# EAGLE design LabPower test3 (EAGLE 7.6.0)

## Sheet 1 of 3: HV Side
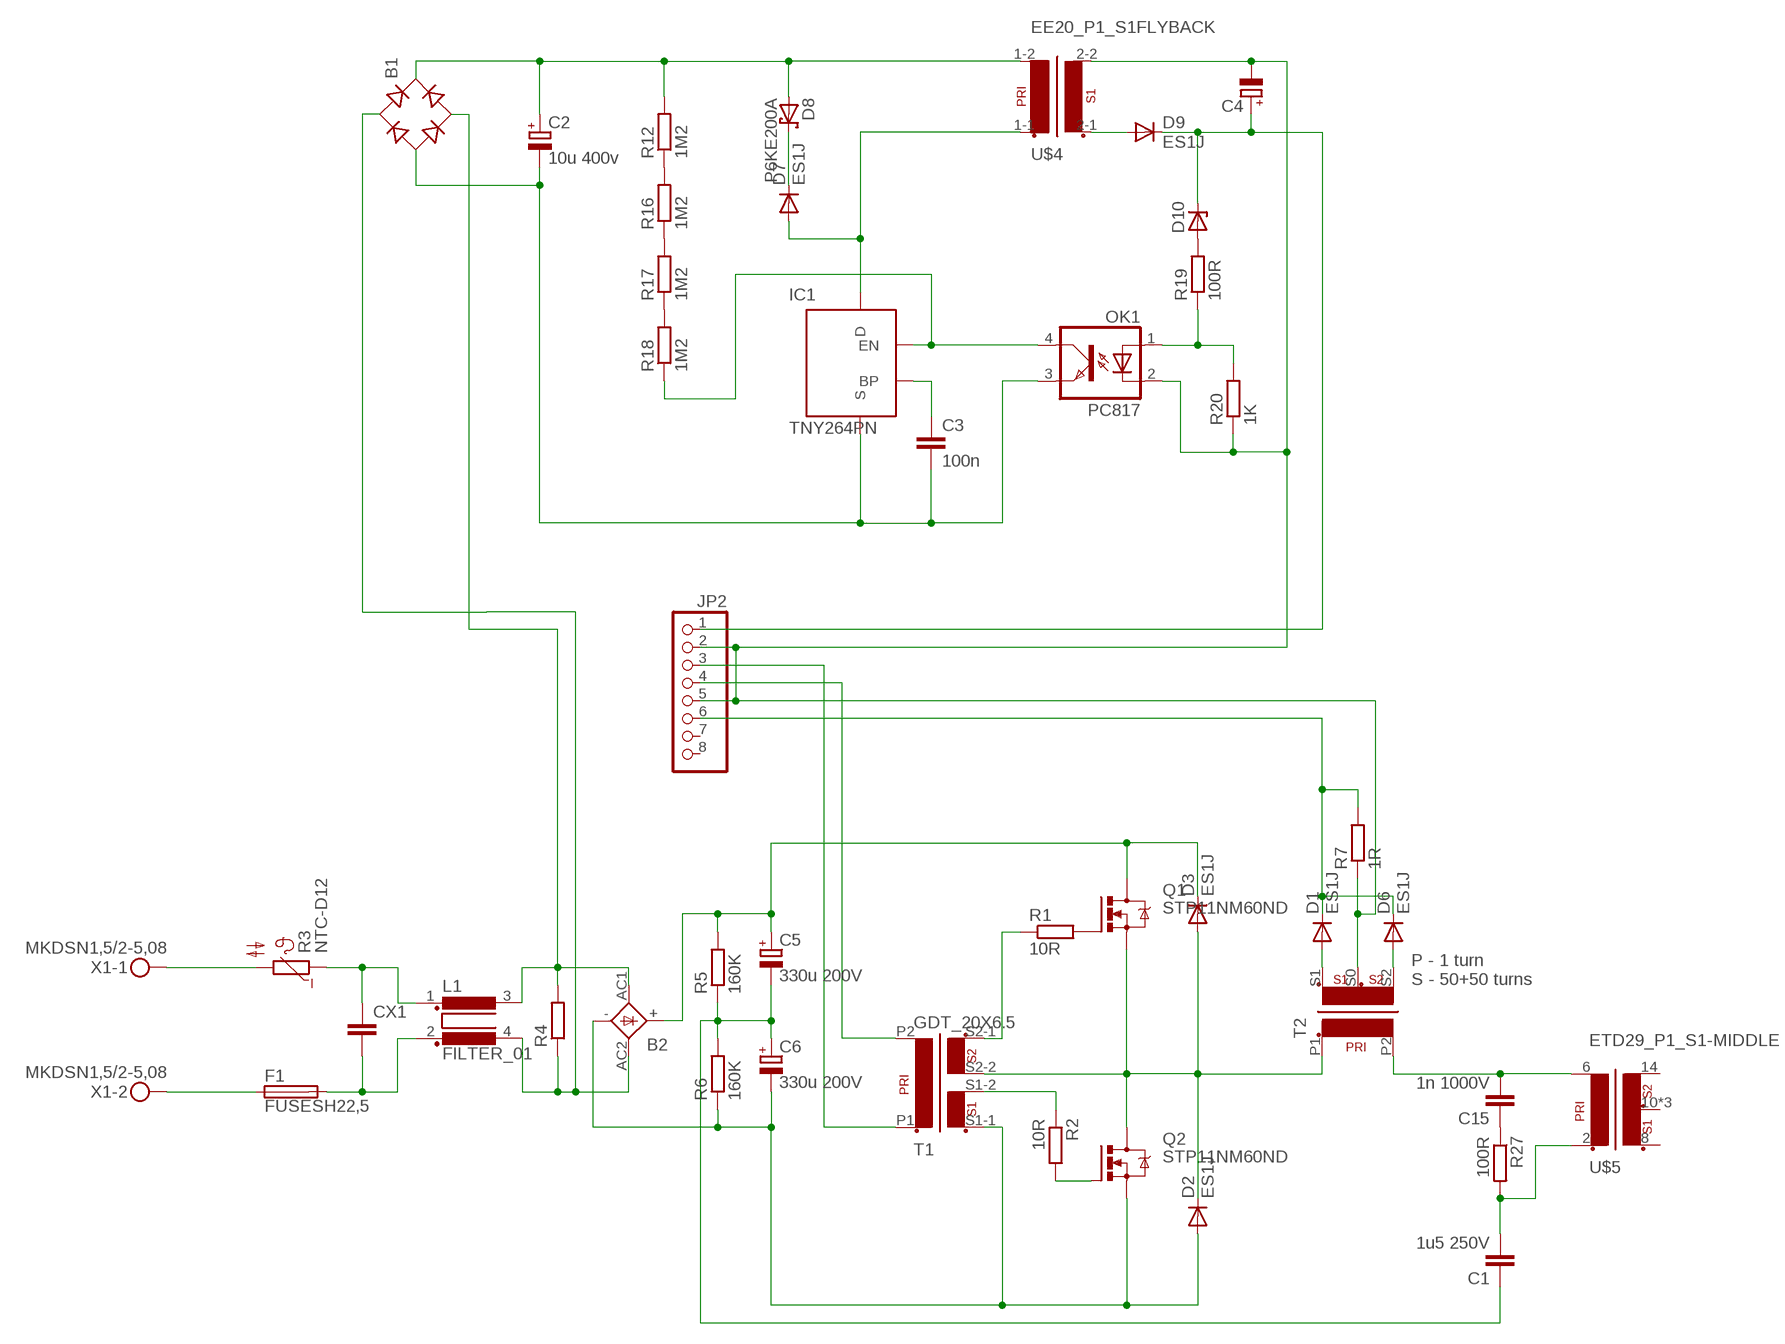
[diagram p0: schematic, sheet 1]

### Parts
B1  RB1A  [RB1A]
B2  KBL  [KBL]
C1  1u5 250V  C-EU225-074X268  [C225-074X268]
C2  10u 400v  CPOL-EUE5-13  [E5-13]
C3  100n  C-EUC0805  [C0805]
C4  CPOL-EUE2.5-7  [E2,5-7]
C5  330u 200V  CPOL-EUE10-22.5  [EB22,5D]
C6  330u 200V  CPOL-EUE10-22.5  [EB22,5D]
C15  1n 1000V  C-EU050-025X075  [C050-025X075]
CX1  CXXC15B8  [XC15B8]
D1  ES1J  DIODE-DO214AC  [DO214AC]
D2  ES1J  DIODE-DO214AC  [DO214AC]
D3  ES1J  DIODE-DO214AC  [DO214AC]
D6  ES1J  DIODE-DO214AC  [DO214AC]
D7  ES1J  DIODE-DO214AC  [DO214AC]
D8  P6KE200A  P6KEXX  [CB417-15]
D9  ES1J  DIODE-DO214AC  [DO214AC]
D10  ZENER-DIODEDO41Z10  [DO41Z10]
F1  FUSESH22,5  [SH22,5]
IC1  TNY264PN  [DIP-8B]
JP2  PINHD-1X8  [1X08]
L1  FILTER_01  [82721K]
OK1  PC817  [DIL04]
Q1  STP11NM60ND  IRF740  [TO220BV]
Q2  STP11NM60ND  IRF740  [TO220BV]
R1  10R  R-EU_R0805  [R0805]
R2  10R  R-EU_R0805  [R0805]
R3  NTC-D12  [NTC-D12]
R4  R-EU_0309/10  [0309/10]
R5  160K  R-EU_0207/12  [0207/12]
R6  160K  R-EU_0207/12  [0207/12]
R7  1R  R-EU_R1206  [R1206]
R12  1M2  R-EU_R0805  [R0805]
R16  1M2  R-EU_R0805  [R0805]
R17  1M2  R-EU_R0805  [R0805]
R18  1M2  R-EU_R0805  [R0805]
R19  100R  R-EU_R0805  [R0805]
R20  1K  R-EU_R0805  [R0805]
R27  100R  R-EU_0617/17  [0617/17]
T1  GDT_20X6.5  [GDT_20X6.5]
T2  CURRENT  [T_10X6X3]
U$4  EE20_P1_S1FLYBACK  [EE20_P1_S1-REV-4PIN]
U$5  ETD29_P1_S1-MIDDLE  [ETD29]
X1  MKDSN1,5/2-5,08  [MKDSN1,5/2-5,08]

### Nets
300V: B2.+ C5.+ D3.C Q1.D R5.2
AC1: B1.AC1 B2.AC2(AC1) L1.4 R4.1
AC2: B1.AC2 B2.AC1(AC2) L1.3 R4.2
N$1: C1.1 C5.- C6.+ R5.1 R6.2
N$2: D2.C D3.A Q1.S Q2.D T1.S2-2 T2.P1(P1-1)
N$3: C1.2 R27.2 U$5.2(P1-1)
N$5: C15.2 T2.P2(P1-2) U$5.6(P1-2)
N$6: F1.1 X1.2
N$7: R3.2 X1.1
N$9: CX1.1 L1.1 R3.1
N$10: CX1.2 F1.2 L1.2
N$17: B2.- C6.- D2.A Q2.S R6.1 T1.S1-1
N$18: JP2.3 T1.P1(P1-1)
N$20: Q1.G R1.2
N$21: Q2.G R2.2
N$22: JP2.4 T1.P2(P1-2)
N$23: R1.1 T1.S2-1
N$24: R2.1 T1.S1-2
N$27: D1.A T2.S1
N$28: D6.A T2.S2
N$30: D1.C D6.C JP2.6 R7.2
N$31: C4.- JP2.2 JP2.5 OK1.2(C) R7.1 R20.1 T2.S0(SM) U$4.2-2(S1-2)
N$32: B1.+ C2.+ D8.A R12.2 U$4.1-2
N$33: C15.1 R27.1
N$35: B1.- C2.- C3.2 IC1.2(S) IC1.3(S) IC1.7(S) IC1.8(S) OK1.3(EMIT)
N$36: D7.A IC1.5(D) U$4.1-1
N$38: D7.C D8.C
N$39: C3.1 IC1.1(BP)
N$40: IC1.4(EN) OK1.4(COL) R18.1
N$41: C4.+ D9.C D10.C JP2.1
N$43: R12.1 R16.2
N$44: R16.1 R17.2
N$45: R17.1 R18.2
N$48: D10.A R19.2
N$49: OK1.1(A) R19.1 R20.2
N$50: D9.A U$4.2-1(S1-1)
Unconnected: JP2.7 JP2.8 U$5.8(S1) U$5.10(SM) U$5.11(SM) U$5.12(SM) U$5.14(S2)

### Notes on the sheet
- P - 1 turn
  S - 50+50 turns

## Sheet 2 of 3: LV Side
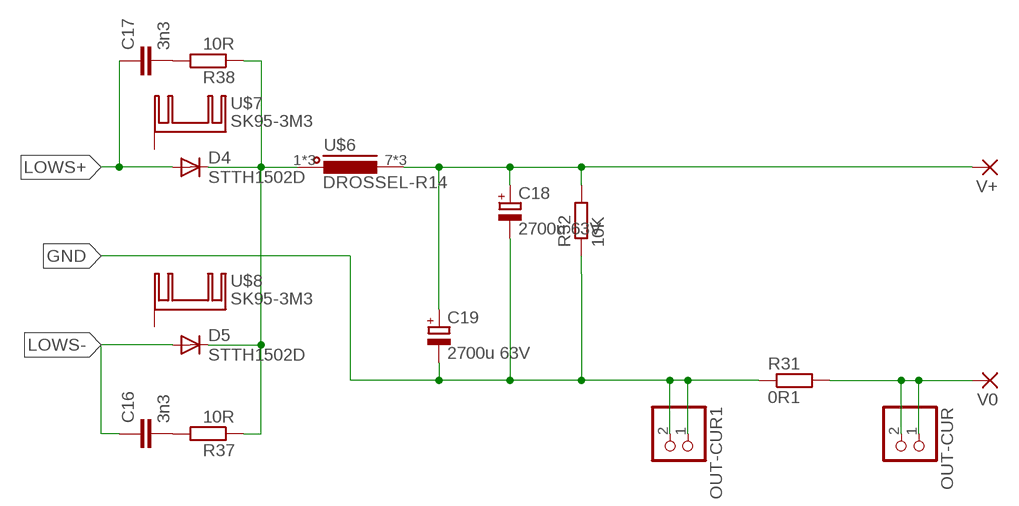
[diagram p1: schematic, sheet 2]

### Parts
C16  3n3  C-EUC0805  [C0805]
C17  3n3  C-EUC0805  [C0805]
C18  2700u 63V  CPOL-EUE7.5-18  [E7,5-18]
C19  2700u 63V  CPOL-EUE7.5-18  [E7,5-18]
D4  STTH1502D  DIODE-DO220S  [DO220S]
D5  STTH1502D  DIODE-DO220S  [DO220S]
OUT-CUR  PINHD-1X2  [1X02]
OUT-CUR1  PINHD-1X2  [1X02]
R31  0R1  R_SQP-10  [SQP-10]
R32  10K  R-EU_0207/10  [0207/10]
R37  10R  R-EU_R0805  [R0805]
R38  10R  R-EU_R0805  [R0805]
U$6  DROSSEL-R14  [RM14]
U$7  SK95-3M3  [SK95-3M3]
U$8  SK95-3M3  [SK95-3M3]
V0  3,81/1,4  [3,81/1,4]
V+  3,81/1,4  [3,81/1,4]

### Nets
GND: C18.- C19.- OUT-CUR1.1 OUT-CUR1.2 R31.P$1 R32.1
LOWS+: C17.1 D4.A
LOWS-: C16.1 D5.A
N$26: D4.C D5.C R37.1 R38.1 U$6.1 U$6.2 U$6.3
N$34: C18.+ C19.+ R32.2 U$6.7 U$6.8 U$6.9 V+.1(P)
N$37: OUT-CUR.1 OUT-CUR.2 R31.P$2 V0.1(P)
N$46: C16.2 R37.2
N$47: C17.2 R38.2
Unconnected: U$7.P$1(K) U$8.P$1(K)

## Sheet 3 of 3: Control
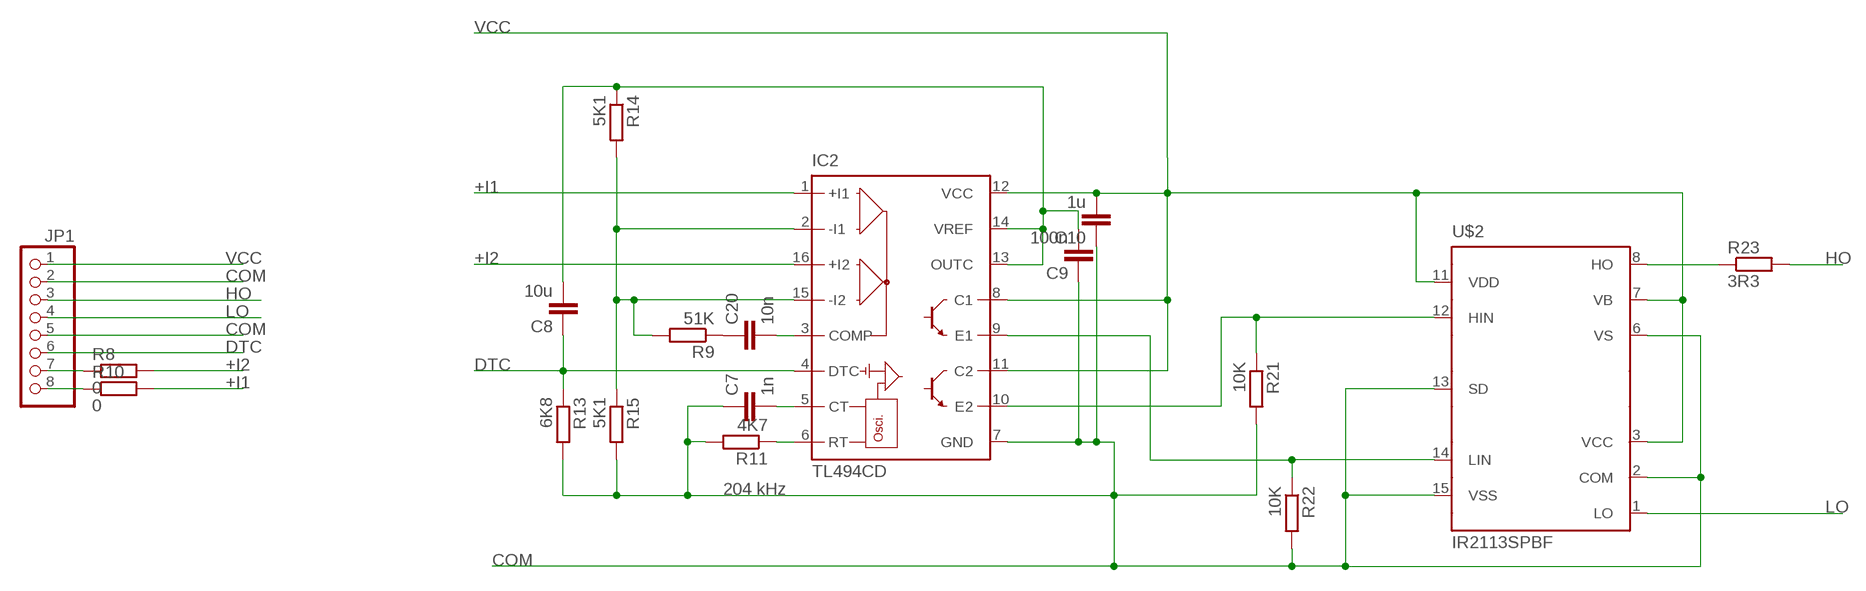
[diagram p2: schematic, sheet 3]

### Parts
C7  1n  C-EUC0805  [C0805]
C8  10u  C-EUC0805  [C0805]
C9  100n  C-EUC0805  [C0805]
C10  1u  C-EUC0805  [C0805]
C20  10n  C-EUC0805  [C0805]
IC2  TL494CD  [SO16]
JP1  PINHD-1X8  [1X08]
R8  0  R-EU_R1206  [R1206]
R9  51K  R-EU_R0805  [R0805]
R10  0  R-EU_R1206  [R1206]
R11  4K7  R-EU_R0805  [R0805]
R13  6K8  R-EU_R0805  [R0805]
R14  5K1  R-EU_R0805  [R0805]
R15  5K1  R-EU_R0805  [R0805]
R21  10K  R-EU_R0805  [R0805]
R22  10K  R-EU_R0805  [R0805]
R23  3R3  R-EU_R1206  [R1206]
U$2  IR2113SPBF  [SO16W]

### Nets
+I1: IC2.1(+I1) R10.2
+I2: IC2.16(+I2) R8.2
COM: C7.1 C9.1 C10.1 IC2.7(GND) JP1.2 JP1.5 R11.2 R13.2 R15.2 R21.2 R22.2 U$2.2(COM) U$2.6(VS) U$2.13(SD) U$2.15(VSS)
DTC: C8.1 IC2.4(DTC) JP1.6 R13.1
HO: JP1.3 R23.2
LO: JP1.4 U$2.1(LO)
N$4: R23.1 U$2.8(HO)
N$8: C8.2 C9.2 IC2.13(OUTC) IC2.14(VREF) R14.1
N$11: C20.1 R9.1
N$12: C20.2 IC2.3(COMP)
N$13: JP1.8 R10.1
N$14: IC2.6(RT) R11.1
N$15: JP1.7 R8.1
N$16: C7.2 IC2.5(CT)
N$19: IC2.2(-I1) IC2.15(-I2) R9.2 R14.2 R15.1
N$25: IC2.10(E2) R21.1 U$2.12(HIN)
N$29: IC2.9(E1) R22.1 U$2.14(LIN)
VCC: C10.2 IC2.8(C1) IC2.11(C2) IC2.12(VCC) JP1.1 U$2.3(VCC) U$2.7(VB) U$2.11(VDD)

### Notes on the sheet
- 204 kHz

## Library data of the parts
B1 = rectifier:RB1A: RECTIFIER 1 A
B2 = rectifier:KBL: DIOTEC RECTIFIER
C1 C3 C7-C10 C15-C17 C20 = rcl:C-EU: CAPACITOR, European symbol
C2 C4-C6 C18 C19 = rcl:CPOL-EU: POLARIZED CAPACITOR, European symbol
CX1 = rcl:CX: X CAPACITOR for power line
D1-D7 D9 = diode:DIODE-: DIODE
D8 = diode:P6KEXX: DIODE transient-voltage suppressor
D10 = diode:ZENER-DIODE: Z-Diode
F1 = fuse:FUSE: Fuse; OC_FARNELL: unknown; OC_NEWARK: unknown
IC1 = Namenlos:TNY264PN
IC2 = linear:TL494*: SWITCHMODE Pulse Width Modulation Control Circuit NCV494B http://onsemi.com tl494-d.pdf
JP1 JP2 = pinhead:PINHD-1X8: PIN HEADER
L1 = _Transformers:FILTER_01
OK1 = optocoupler:PC817: SHARP OPTO COUPLER; MPN: PC817X4J000F; OC_FARNELL: 9707727; OC_NEWARK: 97K7059
OUT-CUR OUT-CUR1 = pinhead:PINHD-1X2: PIN HEADER
Q1 Q2 = transistor-power:IRF740: N-CHANNEL MOS FET
R1 R2 R4-R23 R27 R32 R37 R38 = rcl:R-EU_: RESISTOR, European symbol
R3 = Namenlos:NTC-D12
R31 = Namenlos:R_SQP-10
T1 = _Transformers:GDT_20X6.5
T2 = _Transformers:CURRENT
U$2 = Namenlos:IR2113SPBF
U$4 = _Transformers:EE20_P1_S1
U$5 = _Transformers:ETD29_P1_S1-MIDDLE
U$6 = _Transformers:DROSSEL-R14
U$7 U$8 = heatsink:SK95-3M3
V0 V+ = wirepad:3,81/1,4: THROUGH-HOLE PAD
X1 = con-phoenix-508:MKDSN1,5/2-5,08: MKDSN 1,5/ 2-5,08 Printklemme Nennstrom: 13,5 A Nennspannung: 250 V Rastermaß: 5,08 mm Polzahl: 2 Anschlussart: Schraubanschluss Montage: Löten Anschlussrichtung Leiter/Platine: 0 ° Artikelnummer: 1729128 Source: http://eshop.phoenixcontact.com .. 1729128.pdf

## Net classes
0 default: clearance 0.205 mm

## Board
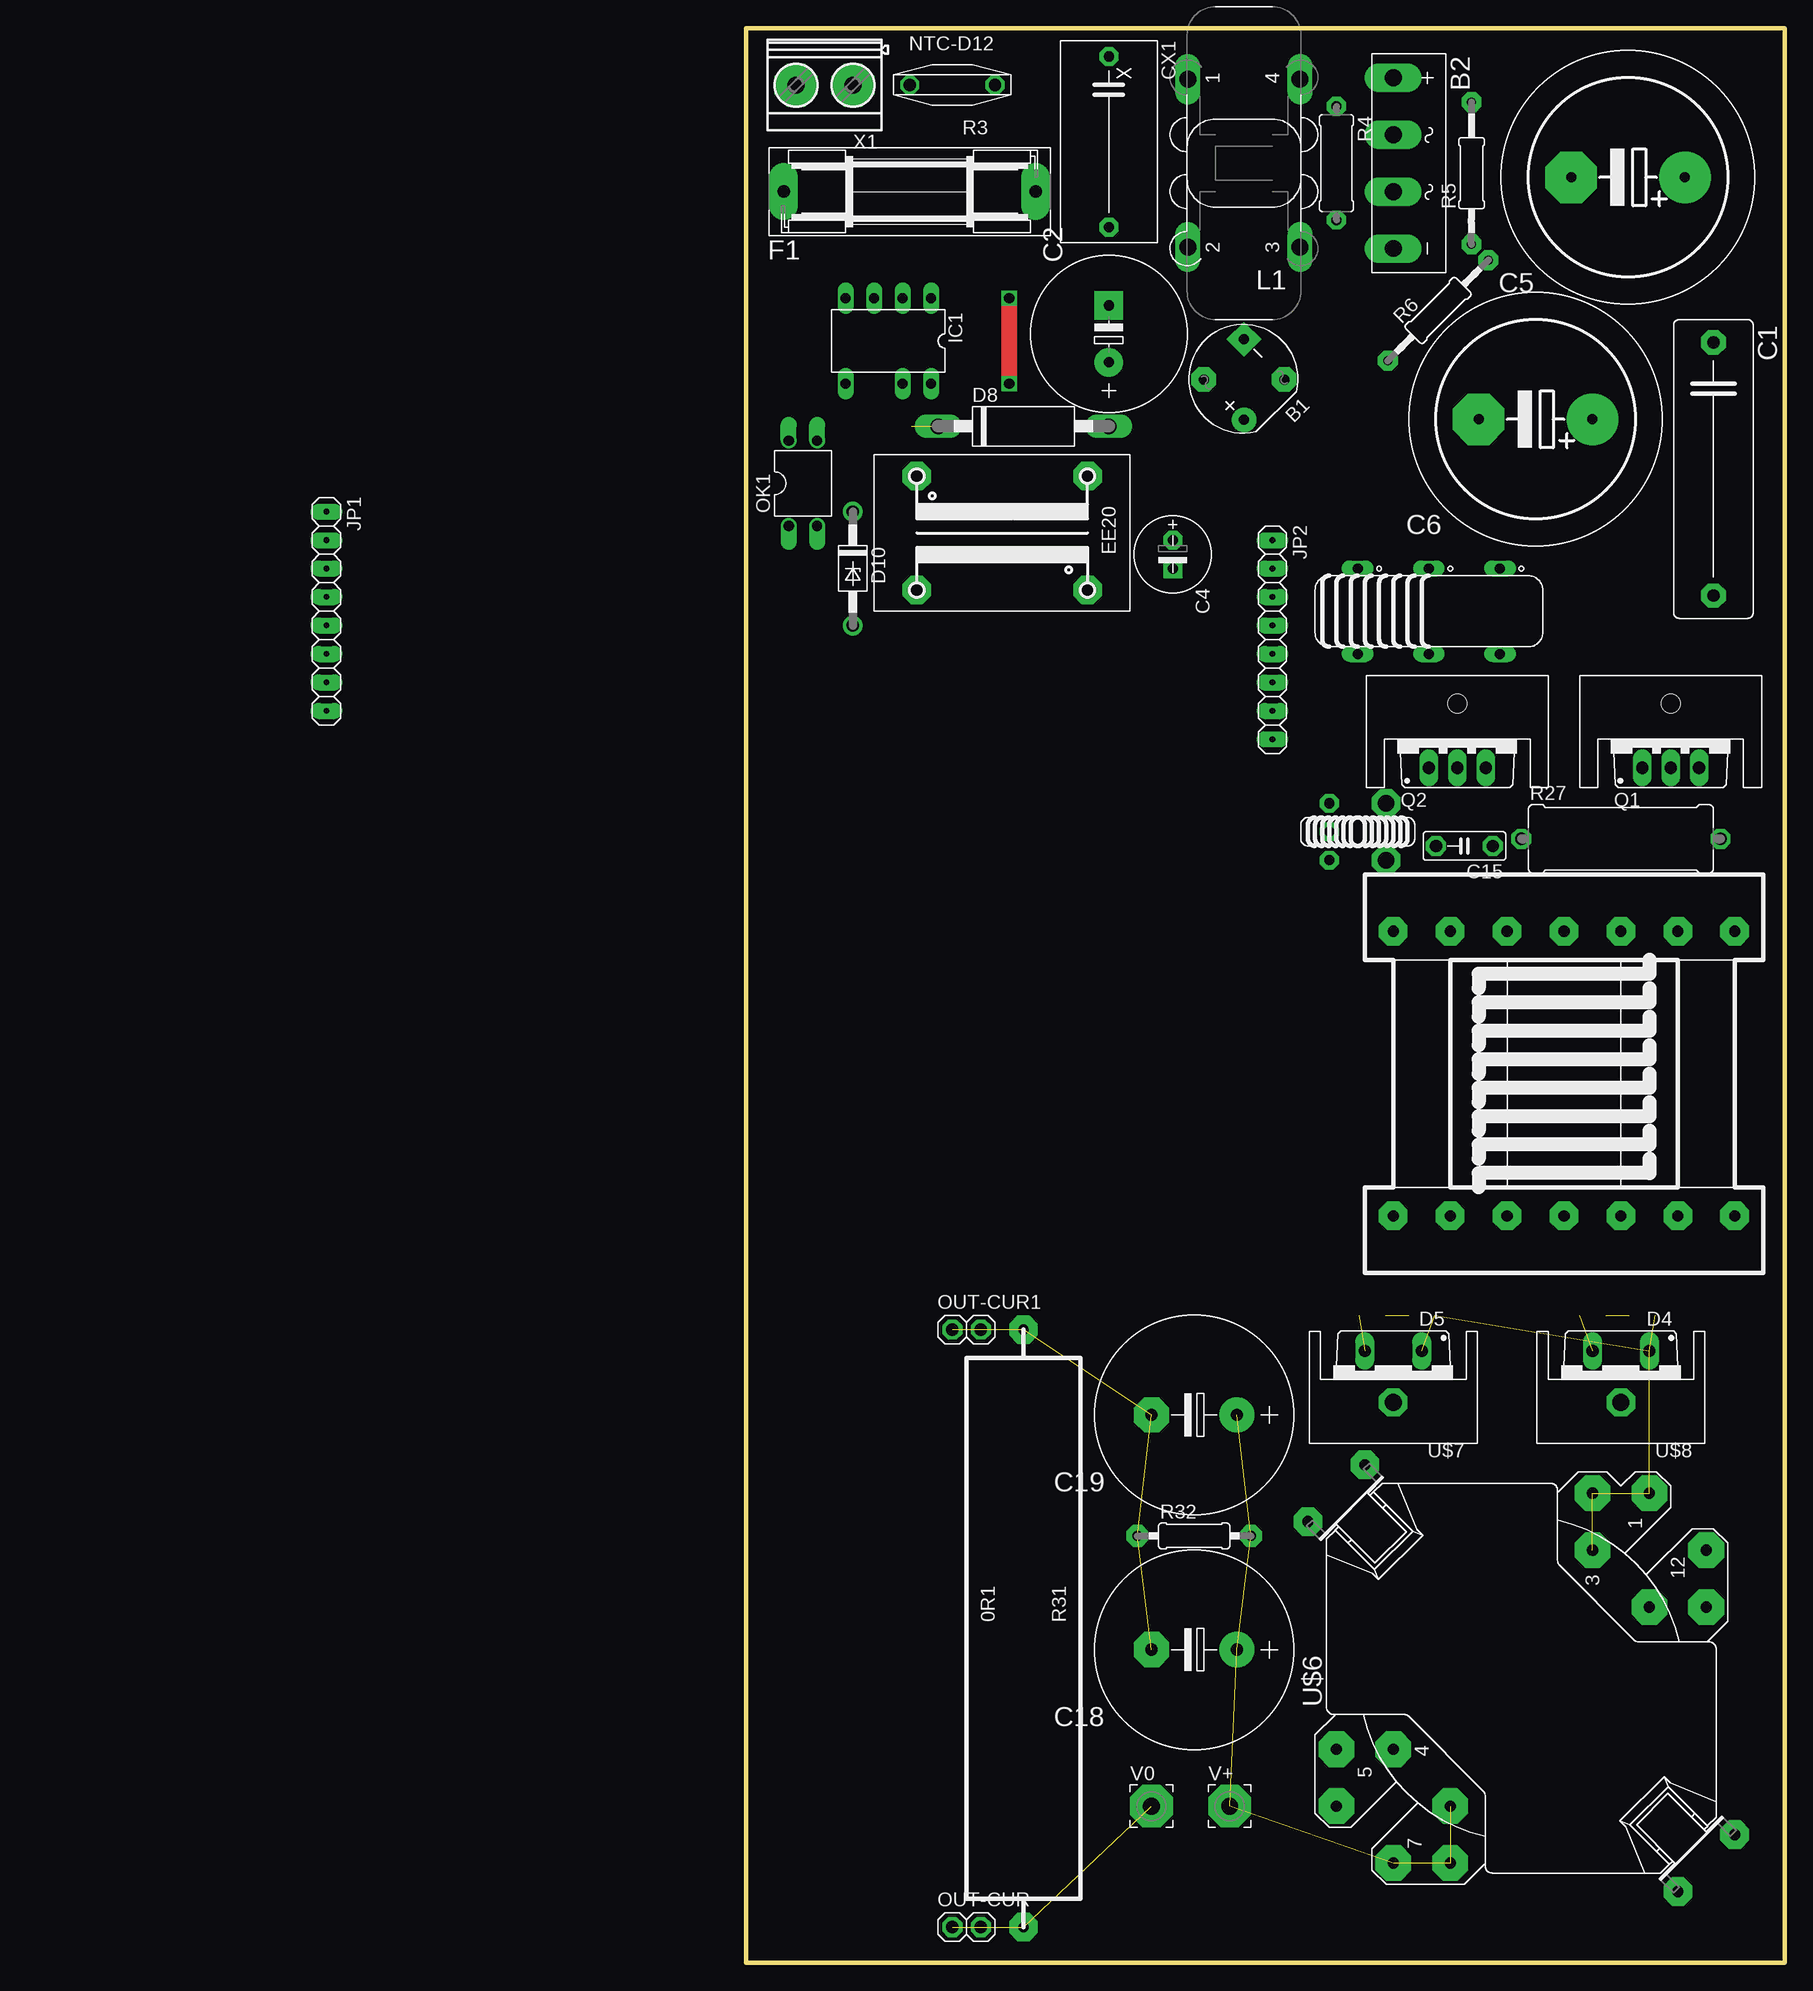
[diagram p3: board, top side]
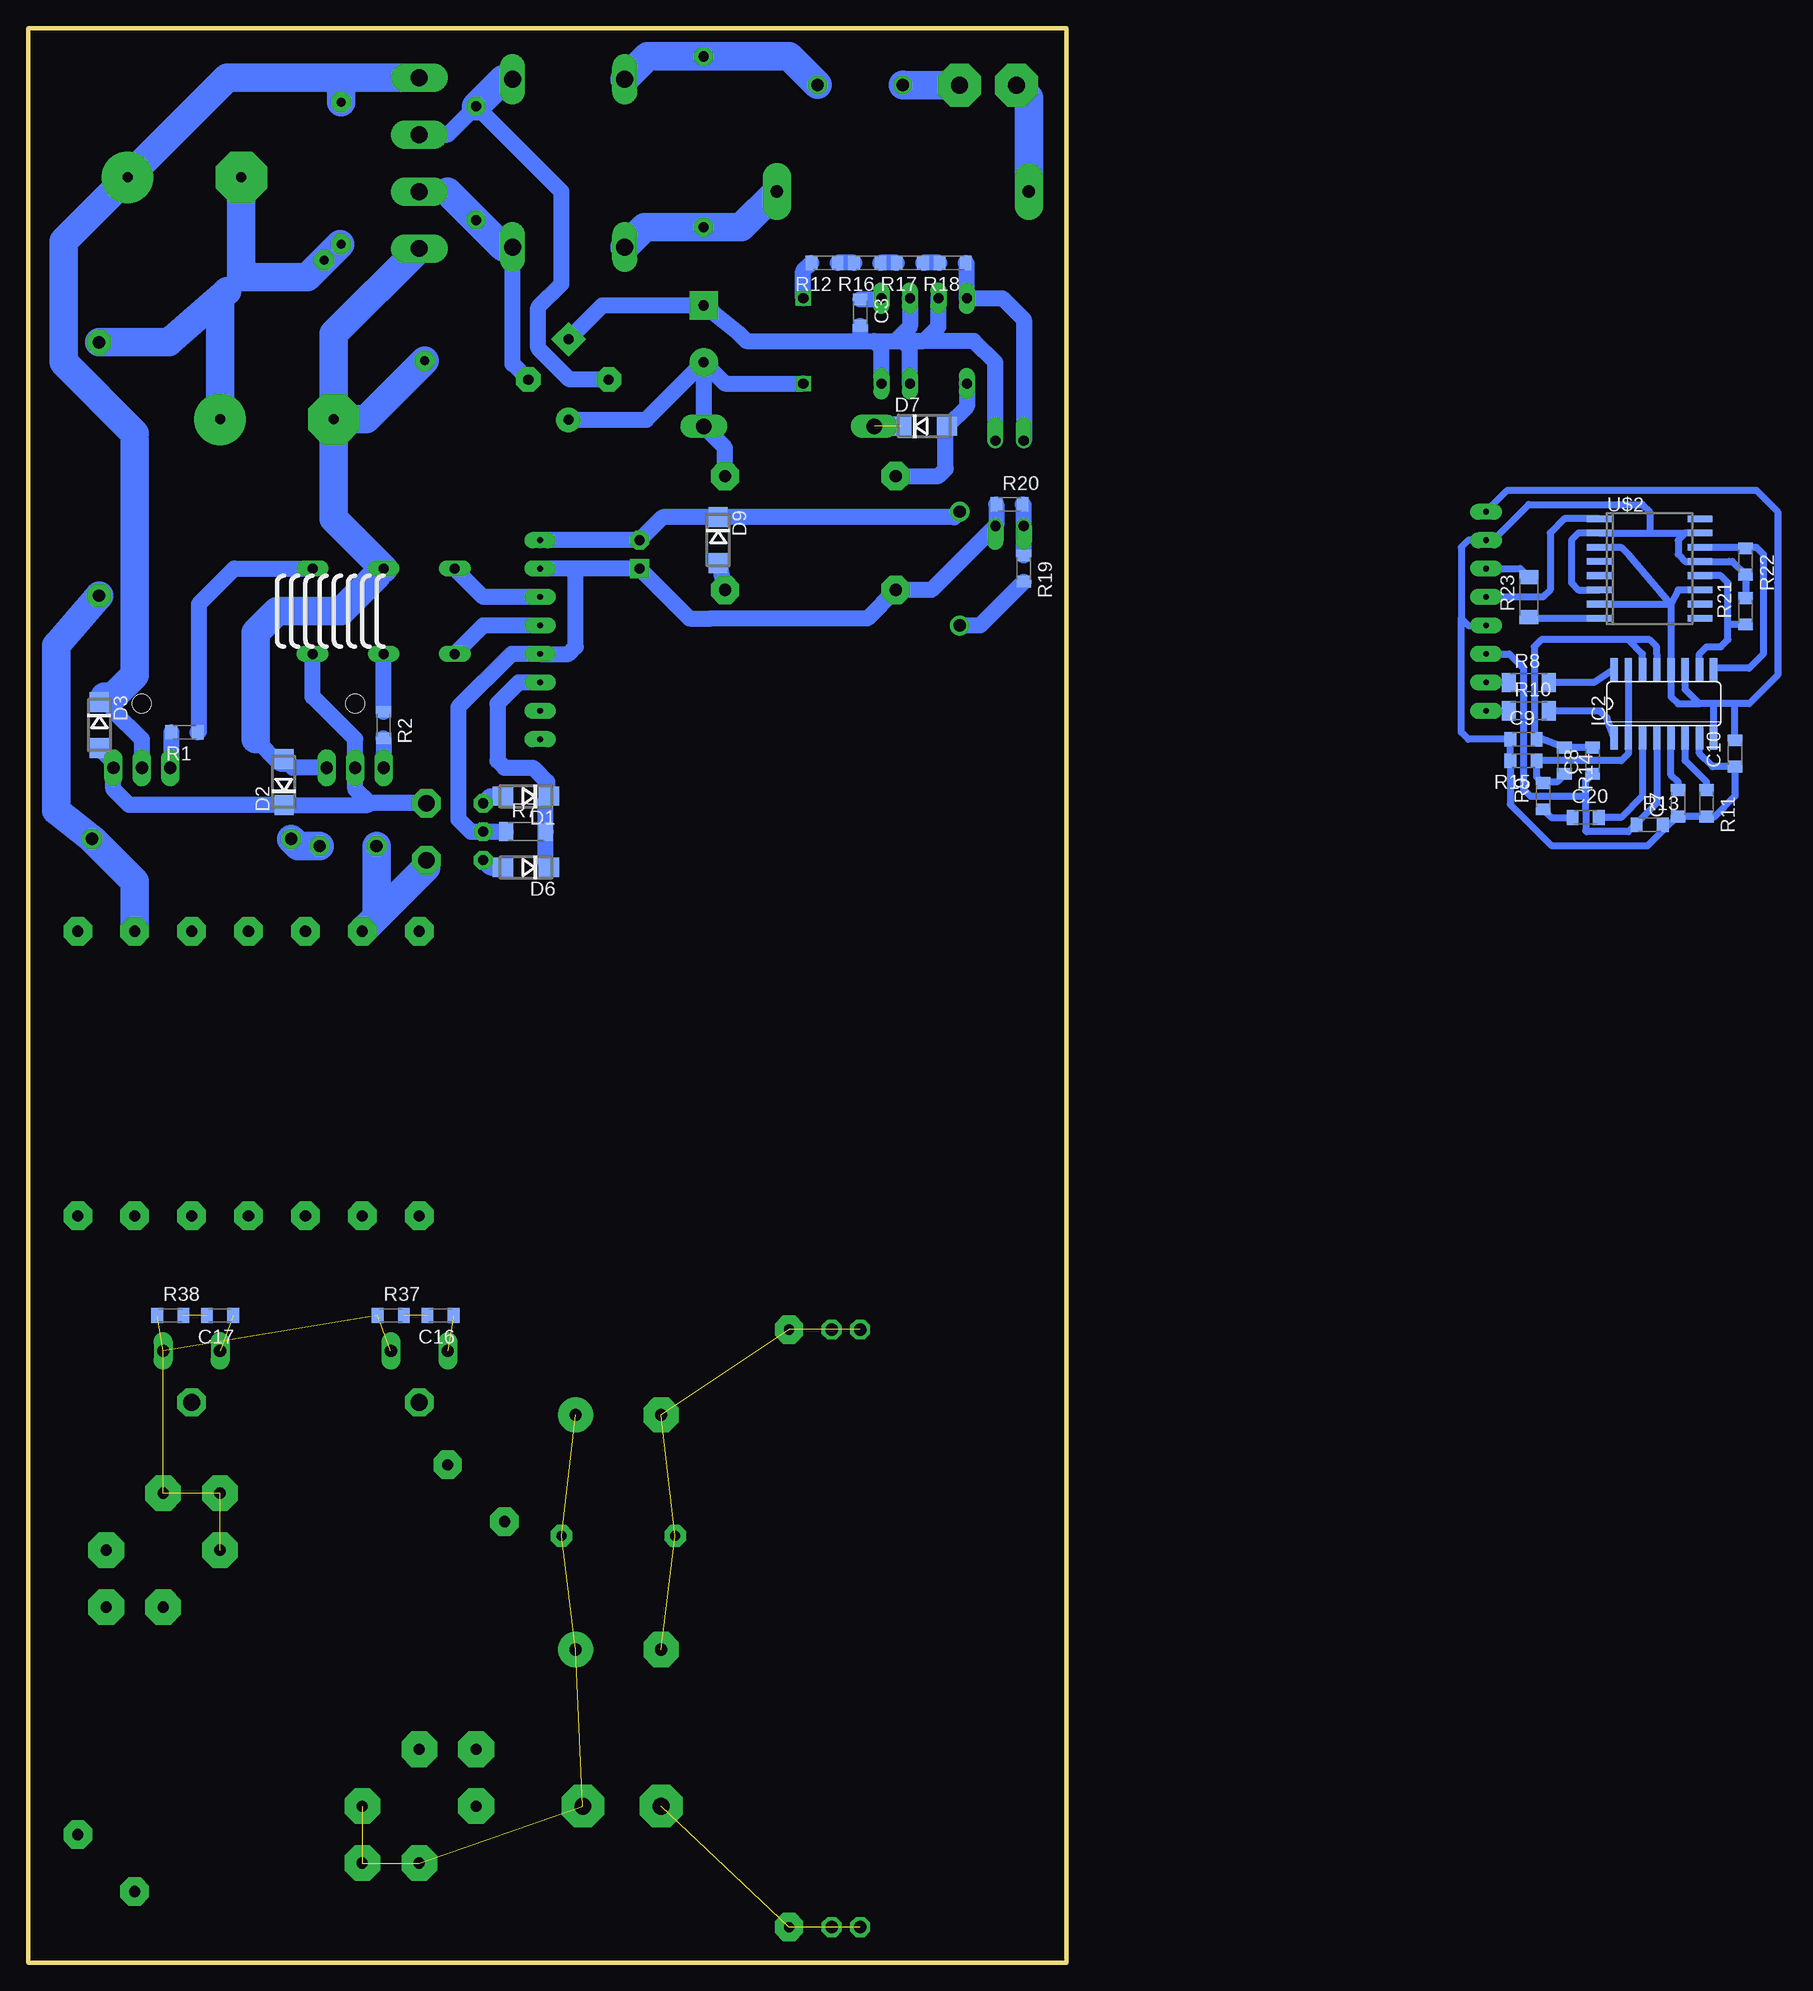
[diagram p4: board, bottom side, seen from below]

Size 92.71 x 172.72 mm. Coordinates in mm from the lower left corner, seen from the top.
Outline: 92.71,172.72 92.71,0 0,0 0,172.72 92.71,172.72
Copper layers (1*16): Top 0.035mm / dielectric 1.5mm / Bottom 0.035mm
Design rules "default *": minimum track width 10mil, minimum drill 24mil, track to track 8mil, track to pad 8mil, pad to pad 8mil, via to via 8mil, smd to smd 8mil, copper to edge 40mil, drill to drill 8mil, minimum pad ring 10mil, minimum via ring 8mil, stop-mask expansion 4mil, vias tented up to drill 0mil, thermal gap 10mil

### Footprints (pad centres in the part's own frame; a part is rotated, then mirrored left to right if it is on the bottom)
RB1A = drill 0.9 pad 2.184: + -2.54,2.54 | drill 0.9 pad 2.184 square: - 2.54,-2.54 | drill 0.9 pad 2.184 octagon: AC1 2.54,2.54; AC2 -2.54,-2.54
KBL = drill 1.5 pad 2.54 long: + -7.62,-1.27; - 7.62,-1.27; AC1 2.54,-1.27; AC2 -2.54,-1.27
C225-074X268 = drill 1.1 pad 2.184 octagon: 1 -11.303,0; 2 11.303,0
E5-13 = drill 0.9 pad 2.54: + -2.54,0 | drill 0.9 pad 2.54 square: - 2.54,0
C0805 = smd 1.05 x 1.3: 1 -1.175,0; 2 1.175,0
E2,5-7 = drill 0.9 pad 1.676 octagon: + -1.27,0 | drill 0.9 pad 1.676 square: - 1.27,0
EB22,5D = drill 0.9 pad 4.597: + -5.08,0 | drill 0.9 pad 4.597 octagon: - 5.08,0
C050-025X075 = drill 1.1 pad 1.778 octagon: 1 -2.54,0; 2 2.54,0
E7,5-18 = drill 1.1 pad 3.15: + -3.81,0 | drill 1.1 pad 3.15 octagon: - 3.81,0
XC15B8 = drill 0.9 pad 1.676 octagon: 1 -7.62,0; 2 7.62,0
DO214AC = smd 1.8 x 1.7: A 2.05,0; C -2.05,0
DO220S = drill 1.1 pad 1.676 long: A 2.54,-2.54; C -2.54,-2.54
CB417-15 = drill 1.397 long: A 7.62,0; C -7.62,0
DO41Z10 = drill 1.1 pad 1.778: A 5.08,0; C -5.08,0
SH22,5 = drill 1.1 pad 2.54 long: 1 -11.252,0; 2 11.252,0
DIP-8B = drill 0.9 long: 1 -3.81,-3.81; 2 -1.27,-3.81; 3 1.27,-3.81; 4 3.81,-3.81; 5 3.81,3.81; 7 -1.27,3.81; 8 -3.81,3.81
SO16 = smd 0.66 x 2.032: 1 -4.445,-3.073; 2 -3.175,-3.073; 3 -1.905,-3.073; 4 -0.635,-3.073; 5 0.635,-3.073; 6 1.905,-3.073; 7 3.175,-3.073; 8 4.445,-3.073; 9 4.445,3.073; 10 3.175,3.073; 11 1.905,3.073; 12 0.635,3.073; 13 -0.635,3.073; 14 -1.905,3.073; 15 -3.175,3.073; 16 -4.445,3.073
1X08 = drill 0.5 pad 1.422 long: 1 -8.89,0; 2 -6.35,0; 3 -3.81,0; 4 -1.27,0; 5 1.27,0; 6 3.81,0; 7 6.35,0; 8 8.89,0
82721K = drill 1.5 long: 1 7.493,5.004; 2 -7.493,5.004; 3 -7.493,-5.004; 4 7.493,-5.004
DIL04 = drill 0.9 pad 1.27 offset: 1 -1.27,-3.81; 2 1.27,-3.81; 3 1.27,3.81; 4 -1.27,3.81
1X02 = drill 1.1 pad 1.778 octagon: 1 -1.27,0; 2 1.27,0
TO220BV = drill 1.1 pad 1.422 long: D 0,-2.54; G -2.54,-2.54; S 2.54,-2.54
R0805 = smd 1.05 x 1.3: 1 -1.175,0; 2 1.175,0
NTC-D12 = drill 1.1 pad 1.676 octagon: 1 -3.81,0; 2 3.81,0
0309/10 = drill 0.9 pad 1.676 octagon: 1 -5.08,0; 2 5.08,0
0207/12 = drill 0.8 pad 1.778 octagon: 1 -6.35,0; 2 6.35,0
R1206 = smd 1.25 x 1.7: 1 -1.775,0; 2 1.775,0
0617/17 = drill 1.1 pad 1.778 octagon: 1 -8.89,0; 2 8.89,0
SQP-10 = drill 0.9 pad 2.54 octagon: P$1 -26.67,0; P$2 26.67,0
0207/10 = drill 0.9 pad 1.93 octagon: 1 -5.08,0; 2 5.08,0
GDT_20X6.5 = drill 0.9 long: P1 -6.35,3.81; P2 -6.35,-3.81; S1-1 0,3.81; S1-2 0,-3.81; S2-1 6.35,3.81; S2-2 6.35,-3.81
T_10X6X3 = drill 1.5 pad 2.54 octagon: P1 2.54,2.54; P2 2.54,-2.54 | drill 0.9 pad 1.676 octagon: S0 -2.54,0; S1 -2.54,2.54; S2 -2.54,-2.54
SK95-3M3_HOLE = hole 1.7: 0,3.175
SO16W = smd 0.6 x 2.2: 1 -4.445,-4.505; 2 -3.175,-4.505; 3 -1.905,-4.505; 4 -0.635,-4.505; 5 0.635,-4.505; 6 1.905,-4.505; 7 3.175,-4.505; 8 4.445,-4.505; 9 4.445,4.505; 10 3.175,4.505; 11 1.905,4.505; 12 0.635,4.505; 13 -0.635,4.505; 14 -1.905,4.505; 15 -3.175,4.505; 16 -4.445,4.505
EE20_P1_S1-REV-4PIN = drill 1.1 pad 2.54 octagon: 1-1 -7.62,5.715; 1-2 7.62,5.715; 2-1 7.62,-4.445; 2-2 -7.62,-4.445
ETD29 = drill 1 pad 2.54 octagon: 1 -15.24,-12.7; 2 -10.16,-12.7; 3 -5.08,-12.7; 4 0,-12.7; 5 5.08,-12.7; 6 10.16,-12.7; 7 15.24,-12.7; 8 15.24,12.7; 9 10.16,12.7; 10 5.08,12.7; 11 0,12.7; 12 -5.08,12.7; 13 -10.16,12.7; 14 -15.24,12.7
RM14 = drill 1 pad 3.175 octagon: 1 16.51,-11.43; 2 16.51,-6.35; 3 11.43,-6.35; 4 -6.35,11.43; 5 -6.35,16.51; 6 -11.43,16.51; 7 -16.51,11.43; 8 -16.51,6.35; 9 -11.43,6.35; 10 6.35,-11.43; 11 6.35,-16.51; 12 11.43,-16.51 | drill 1 pad 2.54 octagon: M -19.05,-13.97; M1 -13.97,-19.05; M2 13.97,19.05; M3 19.05,13.97
SK95-3M3 = drill 1.5 pad 2.54 octagon: P$1 0,2.05
3,81/1,4 = drill 1.5 pad 3.81 octagon: 1 0,0
MKDSN1,5/2-5,08 = drill 1.5 pad 3.81 octagon: 1 -2.561,0.025; 2 2.519,0.025

### Placement (x,y rotation side)
B1  44.45,141.34 135 top
B2  59.05,160.66 270 top
C1  86.36,133.35 270 top
C2  32.38,145.41 90 top
C3  18.42,147.32 270 bottom
C4  38.1,125.73 270 top
C5  78.74,159.38 180 top
C6  70.48,137.79 180 top
C7  -54.61,103.5 90 bottom  (outside the outline)
C8  -46.99,107.31 90 bottom  (outside the outline)
C9  -40.8,109.22 0 bottom  (outside the outline)
C10  -59.69,107.95 90 bottom  (outside the outline)
C15  64.13,99.69 180 top
C16  55.88,57.79 180 bottom
C17  75.56,57.79 180 bottom
C18  40.01,27.94 180 top
C19  40.01,48.9 180 top
C20  -46.35,102.23 0 bottom  (outside the outline)
CX1  32.38,162.56 270 top
D1  48.26,104.14 180 bottom
D2  69.85,105.41 90 bottom
D3  86.36,110.49 270 bottom
D4  78.11,52.07 180 top
D5  57.79,52.07 180 top
D6  48.26,97.79 180 bottom
D7  12.7,137.16 0 bottom
D8  24.77,137.16 0 top
D9  31.12,127 270 bottom
D10  9.53,124.46 270 top
DRILEGEND  [DRILEGEND]  -3.81,-10.16 0 top  (outside the outline)
F1  14.6,158.12 0 top
IC1  12.7,144.78 180 top
IC2  -53.34,112.39 0 bottom  (outside the outline)
JP1  -37.46,120.65 270 top  (outside the outline)
JP2  46.99,118.11 270 top
L1  44.45,160.66 90 top
OK1  5.08,132.08 0 top
OUT-CUR  19.69,3.17 0 top
OUT-CUR1  19.69,56.52 0 top
Q1  82.55,109.22 0 top
Q2  63.5,109.22 0 top
R1  78.74,109.85 180 bottom
R2  60.96,110.49 270 bottom
R3  18.42,167.64 180 top
R4  52.7,160.66 270 top
R5  64.77,159.76 90 top
R6  61.78,147.51 45 top
R7  48.26,100.96 0 bottom
R8  -41.27,114.3 0 bottom  (outside the outline)
R9  -42.55,104.14 90 bottom  (outside the outline)
R10  -41.27,111.76 0 bottom  (outside the outline)
R11  -57.15,103.5 270 bottom  (outside the outline)
R12  21.59,151.76 180 bottom
R13  -52.07,101.6 0 bottom  (outside the outline)
R14  -44.45,107.31 270 bottom  (outside the outline)
R15  -40.8,107.31 180 bottom  (outside the outline)
R16  17.78,151.76 180 bottom
R17  13.97,151.76 180 bottom
R18  10.16,151.76 180 bottom
R19  3.81,124.46 270 bottom
R20  5.08,130.17 0 bottom
R21  -60.64,120.65 90 bottom  (outside the outline)
R22  -60.64,125.09 270 bottom  (outside the outline)
R23  -41.27,121.92 90 bottom  (outside the outline)
R27  78.11,100.33 0 top
R31  24.77,29.85 270 top
R32  40.01,38.1 0 top
R37  60.33,57.79 0 bottom
R38  80.01,57.79 0 bottom
T1  60.96,120.65 0 top
T2  54.61,100.96 0 top
U$1  [SK95-3M3_HOLE]  63.5,109.22 0 top
U$2  -52.07,124.46 270 bottom  (outside the outline)
U$3  [SK95-3M3_HOLE]  82.55,109.22 0 top
U$4  22.86,127 0 top
U$5  73.03,79.38 180 top
U$6  69.22,25.4 90 top
U$7  57.79,52.07 180 top
U$8  78.11,52.07 180 top
V0  36.2,13.97 0 top
V+  43.18,13.97 0 top
X1  6.99,167.64 180 top

### Tracks (layer width: path | path; a pad name or v marks a point on that pad's centre or on a via)
300V
  Bottom 1.422: 83.19,136.53 83.19,135.89 | 85.09,113.03 85.09,111.76 82.55,109.22 Q1.D | D3.C 85.87,113.03 | 64.77,168.28
  Bottom 2.54: B2.+ 64.77,168.28 | 64.77,168.28 74.93,168.28 C5.+ 89.53,153.67 89.53,142.88 83.19,136.53 | R5.2 64.77,168.28 | 83.19,135.89 83.19,114.94 85.09,113.03 85.87,113.03
+I1
  Bottom 0.61: IC2.1 -48.26,111.12 -47.62,111.76 R10.2
+I2
  Bottom 0.61: IC2.16 -47.09,114.3 R8.2
AC1
  Bottom 1.422: L1.4 50.29,168.15 | B2.AC2 55.25,163.19 R4.1 45.09,158.12 45.09,149.86 47.15,147.8 47.15,144.14 44.35,141.34 B1.AC1
  Bottom 2.54: 50.29,168.15 R4.1
AC2
  Bottom 1.422: 50.29,153.16 L1.3 49.45,142.75 B1.AC2 | B2.AC1 55.25,158.12 | 51.44,154.31 R4.2
  Bottom 2.54: 50.29,153.16 R4.2 55.25,158.12
COM
  Bottom 0.61: U$2.6 -45.72,122.56 -45.09,123.19 -45.09,127 -45.72,127.63 U$2.2 -52.07,127.63 | -35.24,120.02 -35.24,126.37 -35.88,127 JP1.2 -38.1,127 -41.27,130.17 -51.44,130.17 -52.07,129.54 -52.07,127.63 | -35.24,120.02 -35.88,119.38 JP1.5 | U$2.15 -55.24,127.63 | -55.24,127.63 -54.61,127 -54.61,125.73 -55.24,125.09 U$2.13 -59.15,125.09 -59.47,125.09 R22.2 R21.2 | -52.07,127.63 -55.24,127.63 | -35.24,120.02 -35.24,109.85 -35.88,109.22 C9.1 R15.2 -39.62,103.41 -43.34,99.69 -43.81,99.69 -51.87,99.69 -53.88,101.71 | -53.88,101.71 C7.1 R11.2 -57.24,102.23 -57.78,102.23 -59.69,104.14 C10.1 -57.69,106.77 -56.52,107.95 IC2.7 | R13.2 -53.35,101.71 -53.88,101.71
DTC
  Bottom 0.61: IC2.4 -52.7,103.5 -50.16,100.96 | -50.16,100.96 -46.45,100.96 -46.35,101.06 -46.35,102.87 -46.35,103.5 -46.35,104.14 | -46.35,104.14 -46.35,105.5 C8.1 | JP1.6 -39.53,116.84 -40.8,115.57 -40.8,104.77 -41.43,104.14 -46.35,104.14 | -50.16,100.96 -50.8,101.6 R13.1
GND  (5 unrouted)
HO
  Bottom 0.61: JP1.3 -40.51,124.46 R23.2
LO
  Bottom 0.61: U$2.1 -44.45,128.91 -43.18,127.63 -43.18,122.56 -42.55,121.92 JP1.4
LOWS+  (1 unrouted)
LOWS-  (1 unrouted)
N$1
  Bottom 1.422: R5.1 64.86,153.41 | 73.66,150.5 74.93,149.22 75.56,148.59
  Bottom 2.54: 64.86,153.41 R6.2 67.77,150.5 73.66,150.5 C5.- | 75.56,148.59 C6.+ | C1.1 80.14,144.65 74.93,149.22
N$2
  Bottom 1.422: T1.S2-2 67.31,113.03 63.5,109.22 Q2.D 63.5,104.77 62.23,103.5 | D3.A 85.09,107.17 Q1.S 85.09,104.77 83.67,103.36 D2.C 62.38,103.36 62.23,103.5 | T2.P1 62.23,103.5
N$3
  Bottom 2.54: U$5.2 83.19,96.52 R27.2 90.17,102.87 90.17,117.6 C1.2
N$4
  Bottom 0.61: U$2.8 -41.41,120.02 R23.1
N$5
  Bottom 1.422: 61.59,93.34 U$5.6 | T2.P2 57.15,97.79
  Bottom 2.54: C15.2 61.59,93.34 | 57.15,97.79 U$5.6
N$6
  Bottom 1.422: X1.2 3.35,166.5
  Bottom 2.54: 3.35,166.5 F1.1
N$7
  Bottom 2.54: X1.1 14.6,167.62 R3.2
N$8
  Bottom 0.61: -51.44,116.84 IC2.14 -51.44,116.84 | -51.44,116.84 -50.16,118.11 | -50.16,118.11 -42.39,118.11 -41.75,117.47 -41.75,109.85 | -41.75,109.85 -41.91,109.31 | -41.91,109.31 -41.75,109.85 | IC2.13 -52.7,116.84 -52.7,117.47 -52.07,118.11 -50.16,118.11 | -41.75,109.85 -41.91,109.31 | -41.91,109.31 C9.2 -42.45,109.22 R14.1 C8.2
N$9
  Bottom 2.54: R3.1 24.77,170.18 CX1.1 37.41,170.18 L1.1
N$10
  Bottom 2.54: F1.2 29.03,154.94 CX1.2 37.67,154.94 L1.2
N$11
  Bottom 0.61: -45.09,102.33 C20.1 -43.27,102.23 R9.1
N$12
  Bottom 0.61: IC2.3 -51.44,104.14 -49.53,102.23 C20.2
N$13
  Bottom 0.61: R10.1 JP1.8
N$14
  Bottom 0.61: R11.1 -57.15,105.41 -55.24,107.31 IC2.6
N$15
  Bottom 0.61: R8.1 JP1.7
N$16
  Bottom 0.61: C7.2 -54.61,105.41 -53.98,106.05 IC2.5
N$17
  Bottom 1.422: T1.S1-1 61.59,123.82 | Q2.S 69.07,106.68 69.46,107.07 | 69.46,107.07 D2.A | 72.39,109.22 70.24,107.07 69.46,107.07
  Bottom 2.54: R6.1 62.51,137.79 C6.- | B2.- 65.41,145.41 C6.- | 61.59,123.82 64.77,120.65 70.48,120.65 72.39,118.74 72.39,109.22 | C6.- 65.41,128.91 T1.S1-1
N$18
  Bottom 1.422: JP2.3 52.07,121.92 T1.P1
N$19
  Bottom 0.61: IC2.15 IC2.2 -50.16,107.95 -49.53,107.31 R15.1 -41.97,105.89 R9.2 -42.64,105.41 -43.81,105.41 -44.45,106.05 R14.2
N$20
  Bottom 1.422: R1.2 79.92,106.77 Q1.G
N$21
  Bottom 1.422: R2.2 Q2.G
N$22
  Bottom 1.422: JP2.4 52.07,119.38 T1.P2
N$23
  Bottom 1.422: T1.S2-1 74.3,124.46 77.47,121.28 77.47,109.95 R1.1
N$24
  Bottom 1.422: R2.1 T1.S1-2
N$25
  Bottom 0.61: IC2.10 -56.52,116.84 -57.15,117.47 -58.42,117.47 -59.05,118.11 -59.05,119.38 | -59.05,119.38 -59.05,122.56 -59.05,123.19 -58.42,123.82 U$2.12 | R21.1 -59.15,119.47 -59.05,119.38
N$26  (6 unrouted)
N$27
  Bottom 1.422: T2.S1 51.44,104.14 D1.A
N$28
  Bottom 1.422: T2.S2 51.44,97.79 D6.A
N$29
  Bottom 0.61: U$2.14 -60.32,126.37 | -60.32,126.37 -61.59,126.37 -62.23,125.73 -62.23,124.46 -62.23,116.84 | -62.23,116.84 -61.91,116.52 | -61.91,116.52 -60.96,115.57 -57.89,115.57 IC2.9 | R22.1 -60.32,126.37 | -62.23,116.84 -61.91,116.52
N$30
  Bottom 1.422: D6.C 46.48,98.06 R7.2 46.48,103.86 D1.C 46.36,104.28 46.36,105.41 47.62,106.68 50.16,106.68 50.8,107.31 50.8,112.39 48.9,114.3 JP2.6
N$31
  Bottom 1.422: R20.1 6.25,128.37 OK1.2 12.06,122.56 U$4.2-2 17.78,120.02 31.75,120.02 33.66,120.02 C4.- 43.81,124.46 | R7.1 T2.S0 53.18,100.96 54.29,102.08 54.29,112.08 49.53,116.84 JP2.5 44.45,116.84 43.81,117.47 43.81,124.46 | 43.81,124.46 JP2.2
N$32  (via drill 0.9)
  Top 1.422: v23.5,140.97 v23.5,148.59
  Bottom 1.422: B1.+ 37.51,137.75 C2.+ | C2.+ D8.A 30.48,135.25 U$4.1-2 | C2.+ 30.48,140.97 v23.5,140.97 | v23.5,148.59 23.5,151.03 R12.2
N$33
  Bottom 2.54: R27.1 68.58,99.69 C15.1
N$34  (6 unrouted)
N$35
  Bottom 1.422: B1.- 41.43,147.95 C2.- 29.21,145.41 28.58,144.78 18.42,144.78 | 18.42,144.78 17.14,144.78 | 17.14,144.78 15.24,144.78 | 15.24,144.78 14.6,144.78 | 14.6,144.78 13.97,144.78 | 13.97,144.78 12.7,144.78 11.43,146.05 IC1.3 | IC1.2 13.97,146.05 15.24,144.78 | IC1.7 13.97,144.14 14.6,144.78 | IC1.8 16.51,144.14 17.14,144.78 | C3.2 18.42,144.78 | OK1.3 6.35,142.88 8.25,144.78 13.97,144.78
N$36
  Bottom 1.422: IC1.5 8.89,138.92 D7.A 10.79,137.01 10.79,133.35 11.43,132.72 U$4.1-1
N$37  (3 unrouted)
N$38  (1 unrouted)
N$39
  Bottom 1.422: C3.1 16.61,148.5 IC1.1
N$40
  Bottom 1.422: OK1.4 3.81,146.69 5.71,148.59 IC1.4 8.89,151.67 R18.1
N$41
  Bottom 1.422: D10.C 10.01,129.05 D9.C 36.05,129.05 C4.+ JP2.1
N$43
  Bottom 1.422: R16.2 R12.1
N$44
  Bottom 1.422: R17.2 R16.1
N$45
  Bottom 1.422: R18.2 R17.1
N$46  (1 unrouted)
N$47  (1 unrouted)
N$48
  Bottom 1.422: R19.2 7.71,119.38 D10.A
N$49
  Bottom 1.422: R20.2 3.81,130.08 OK1.1 R19.1
N$50
  Bottom 1.422: U$4.2-1 30.97,124.95 D9.A
VCC
  Bottom 0.61: JP1.1 -39.37,131.44 -50.8,131.44 -61.59,131.44 -63.5,129.54 -63.5,123.19 -63.5,114.94 -60.96,112.39 -59.69,112.39 | -59.69,112.39 -57.78,112.39 | -57.78,112.39 -56.52,112.39 | -56.52,112.39 -55.24,113.66 IC2.11 | -56.52,112.39 -54.61,112.39 -53.98,113.03 IC2.12 -53.98,121.28 | IC2.8 -57.78,112.39 | U$2.7 -49.53,121.28 -53.98,121.28 | U$2.3 -49.53,126.37 -50.16,125.73 -53.98,121.28 | U$2.11 -54.61,122.56 -53.98,121.28 | C10.2 -59.69,112.39